# Altium project RK3568_train.PrjPcb (part 4 of 6)

## Sheet RGMII.schdoc: =
size A3; Symbol: Sheet-Symbol_A4; Company: 嘉立创EDA; Version: V1.0; Page Size: A4; @Project Name: RK3568B2地瓜派; @Page Count: 27; @Update Date: 2025-09-23; @Create Date: 2025-09-11; @Schematic Name: Schematic1; @Page No: 20; @Page Name: RGMII; Device: Sheet-Symbol_A4; Border: 1; Title Block Position: 3; Width: 1655; Height: 1170; Region Start: 1; X Region Count: 6; Y Region Count: 4; Blade Width: 10; @Board Name: Board1; @Create Time: 22:20:05; @Update Time: 09:49:09; Organization: ORGANIZATION; Address1: ADDRESS 1; Address2: ADDRESS 2; Address3: ADDRESS 3; Address4: ADDRESS 4; Revision: V1.0.0; SheetNumber: 19; SheetTotal: 28
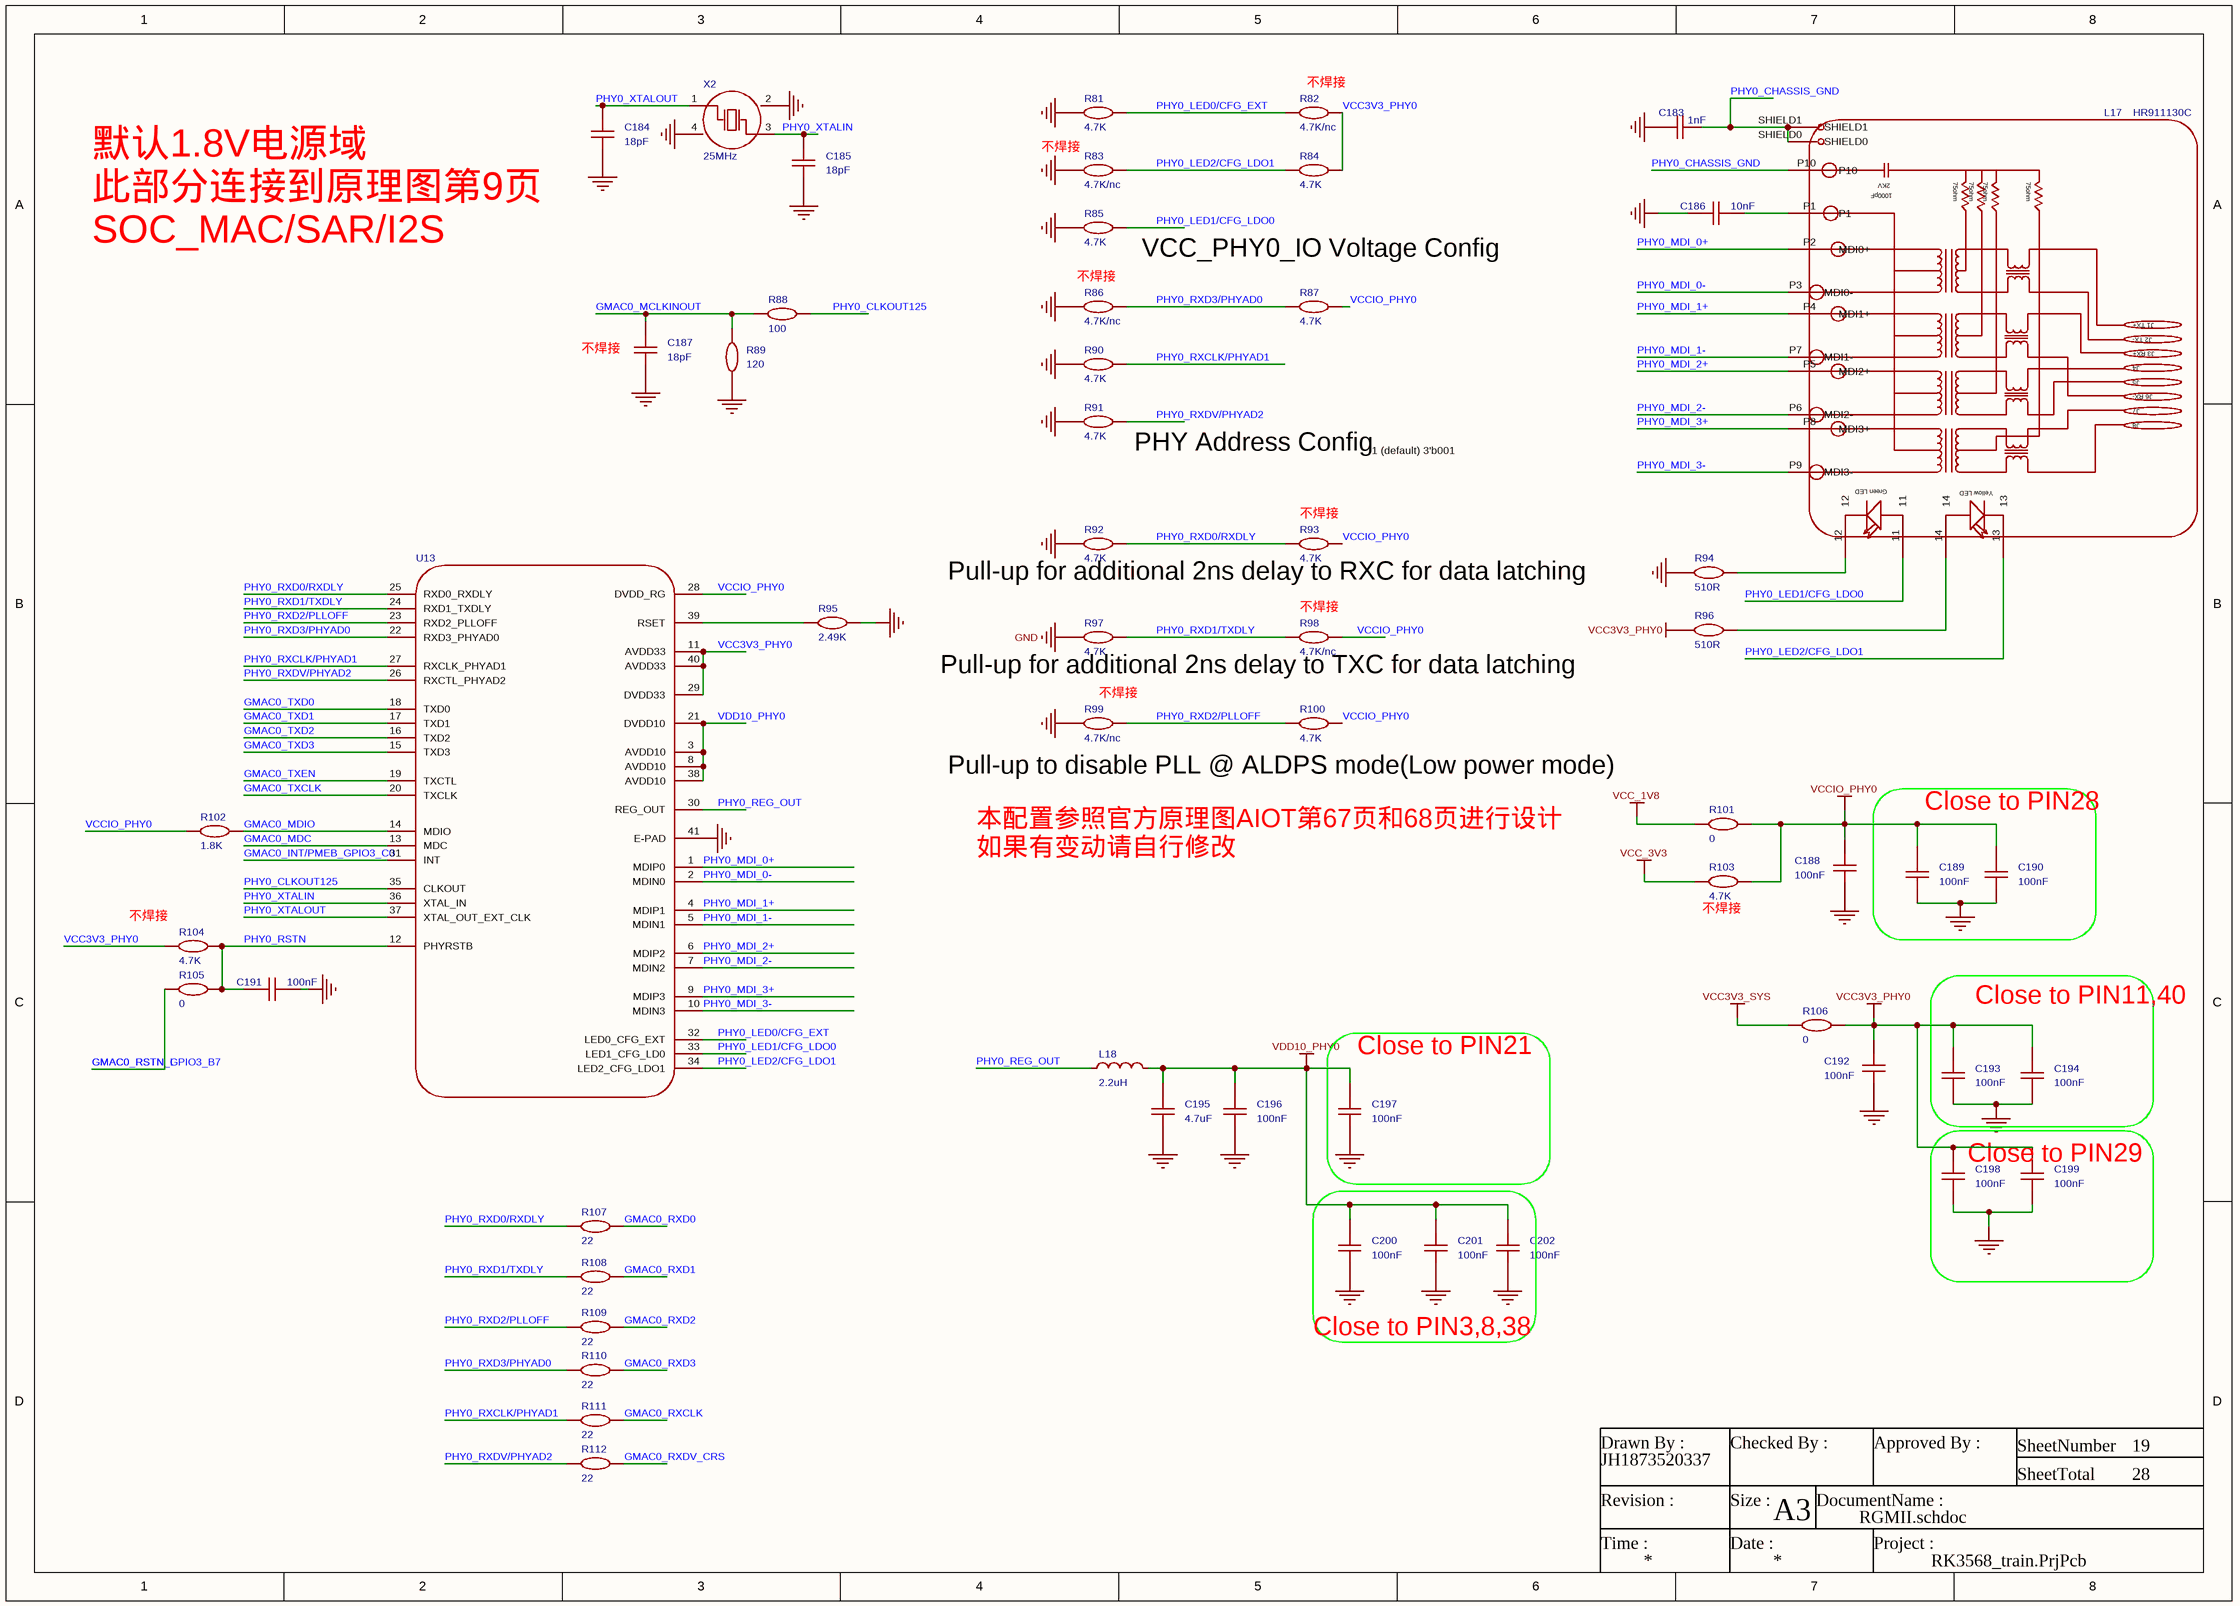
[diagram p18: RGMII.schdoc]

### Parts
C183  1nF  [C1206]
C184  value 18pF  [MYC0402]  (hidden comment: CL10A105KB8NNNC)
C185  value 18pF  [MYC0402]  (hidden comment: CL10A105KB8NNNC)
C186  value 10nF  [MYC0402]  (hidden comment: CL10A105KB8NNNC)
C187  value 18pF  [MYC0402]  (hidden comment: CL10A105KB8NNNC)
C188  100nF  [C0603]
C189  value 100nF  [MYC0402]  (hidden comment: CL10A105KB8NNNC)
C190  value 100nF  [MYC0402]  (hidden comment: CL10A105KB8NNNC)
C191  value 100nF  [MYC0402]  (hidden comment: CL10A105KB8NNNC)
C192  100nF  [C0603]
C193  value 100nF  [MYC0402]  (hidden comment: CL10A105KB8NNNC)
C194  value 100nF  [MYC0402]  (hidden comment: CL10A105KB8NNNC)
C195  4.7uF  [C0603]
C196  value 100nF  [MYC0402]  (hidden comment: CL10A105KB8NNNC)
C197  value 100nF  [MYC0402]  (hidden comment: CL10A105KB8NNNC)
C198  100nF  [C0603]
C199  value 100nF  [MYC0402]  (hidden comment: CL10A105KB8NNNC)
C200  value 100nF  [MYC0402]  (hidden comment: CL10A105KB8NNNC)
C201  value 100nF  [MYC0402]  (hidden comment: CL10A105KB8NNNC)
C202  value 100nF  [MYC0402]  (hidden comment: CL10A105KB8NNNC)
L17  HR911130C  [RJ45-TH_HR911130C]
L18  2.2uH  [IND-SMD_L2.5-W2.0_MHCHL2520]
R81  4.7K  [R0402]
R82  4.7K/nc  [R0402]
R83  4.7K/nc  [R0402]
R84  4.7K  [R0402]
R85  4.7K  [R0402]
R86  4.7K/nc  [R0402]
R87  4.7K  [R0402]
R88  100  [R0402]
R89  120  [R0402]
R90  4.7K  [R0402]
R91  4.7K  [R0402]
R92  4.7K  [R0402]
R93  4.7K  [R0402]
R94  510R  [R0402]
R95  2.49K  [R0402]
R96  510R  [R0402]
R97  4.7K  [R0402]
R98  4.7K/nc  [R0402]
R99  4.7K/nc  [R0402]
R100  4.7K  [R0402]
R101  0  [R0603]
R102  1.8K  [R0402]
R103  4.7K  [R0402]  (no BOM)
R104  4.7K  [R0402]
R105  0  [R0402]
R106  0  [R0603]
R107  22  [R0402]
R108  22  [R0402]
R109  22  [R0402]
R110  22  [R0402]
R111  22  [R0402]
R112  22  [R0402]
U13  (no value)  [RTL8211F-CG]
X2  25MHz  [CRYSTAL-SMD_4P-L3.2-W2.5-BL]

### Blocks framed on the sheet
Close to PIN28: C189 C190
Close to PIN11,40: C193 C194
Close to PIN21: C197
Close to PIN29: C198 C199
Close to PIN3,8,38: C200-C202

### Nets
GND: C183.1 C184.2 C185.2 C186.2 C187.2 C188.1 C189.2 C190.2 C191.1 C192.1 C193.2 C194.2 C195.1 C196.2 C197.2 C198.1 C199.2 C200.2 C201.2 C202.2 R81.1 R83.1 R85.1 R86.1 R89.1 R90.1 R91.1 R92.1 R94.1 R95.2 R97.1 R99.1 U13.41(E-PAD) X2.2(GND) X2.4(GND)
VCC3V3_PHY0: C192.2 C193.1 C194.1 C198.2 C199.1 R82.2 R84.2 R96.1 R104.1 R106.2 U13.11(AVDD33) U13.29(DVDD33) U13.40(AVDD33)
VCC3V3_SYS: R106.1
VCC_1V8: R101.1  [project net LCD_1V8]
VCC_3V3: R103.1  [project net TP_3V3]
VCCIO_PHY0: C188.2 C189.1 C190.1 R87.2 R93.2 R98.2 R100.2 R101.2 R102.1 R103.2 U13.28(DVDD_RG)
VDD10_PHY0: C195.2 C196.1 C197.1 C200.1 C201.1 C202.1 L18.2 U13.3(AVDD10) U13.8(AVDD10) U13.21(DVDD10) U13.38(AVDD10)
GMAC0_INT/PMEB_GPIO3_C0: U13.31(INT)
GMAC0_MCLKINOUT: C187.1 R88.1 R89.2
GMAC0_MDC: U13.13(MDC)
GMAC0_MDIO: R102.2 U13.14(MDIO)
GMAC0_RSTN_GPIO3_B7: R105.1  [also labelled GMAC0_RSTN_L]
GMAC0_RXCLK: R111.2
GMAC0_RXD0: R107.2
GMAC0_RXD1: R108.2
GMAC0_RXD2: R109.2
GMAC0_RXD3: R110.2
GMAC0_RXDV_CRS: R112.2
GMAC0_TXCLK: U13.20(TXCLK)
GMAC0_TXD0: U13.18(TXD0)
GMAC0_TXD1: U13.17(TXD1)
GMAC0_TXD2: U13.16(TXD2)
GMAC0_TXD3: U13.15(TXD3)
GMAC0_TXEN: U13.19(TXCTL)
PHY0_CHASSIS_GND: C183.2 L17.P10 L17.SHIELD0 L17.SHIELD1
PHY0_CLKOUT125: R88.2 U13.35(CLKOUT)
PHY0_LED0/CFG_EXT: R81.2 R82.1 U13.32(LED0_CFG_EXT)
PHY0_LED1/CFG_LDO0: L17.11 R85.2 U13.33(LED1_CFG_LD0)
PHY0_LED2/CFG_LDO1: L17.13 R83.2 R84.1 U13.34(LED2_CFG_LDO1)
PHY0_MDI_0+: L17.P2(MDI0+) U13.1(MDIP0)
PHY0_MDI_0-: L17.P3(MDI0-) U13.2(MDIN0)
PHY0_MDI_1+: L17.P4(MDI1+) U13.4(MDIP1)
PHY0_MDI_1-: L17.P7(MDI1-) U13.5(MDIN1)
PHY0_MDI_2+: L17.P5(MDI2+) U13.6(MDIP2)
PHY0_MDI_2-: L17.P6(MDI2-) U13.7(MDIN2)
PHY0_MDI_3+: L17.P8(MDI3+) U13.9(MDIP3)
PHY0_MDI_3-: L17.P9(MDI3-) U13.10(MDIN3)
PHY0_REG_OUT: L18.1 U13.30(REG_OUT)
PHY0_RSTN: C191.2 R104.2 R105.2 U13.12(PHYRSTB)
PHY0_RXCLK/PHYAD1: R90.2 R111.1 U13.27(RXCLK_PHYAD1)
PHY0_RXD0/RXDLY: R92.2 R93.1 R107.1 U13.25(RXD0_RXDLY)
PHY0_RXD1/TXDLY: R97.2 R98.1 R108.1 U13.24(RXD1_TXDLY)
PHY0_RXD2/PLLOFF: R99.2 R100.1 R109.1 U13.23(RXD2_PLLOFF)
PHY0_RXD3/PHYAD0: R86.2 R87.1 R110.1 U13.22(RXD3_PHYAD0)
PHY0_RXDV/PHYAD2: R91.2 R112.1 U13.26(RXCTL_PHYAD2)
PHY0_XTALIN: C185.1 U13.36(XTAL_IN) X2.3(OSC2)
PHY0_XTALOUT: C184.1 U13.37(XTAL_OUT_EXT_CLK) X2.1(OSC1)
NetC186_1: C186.1 L17.P1
NetL17_12: L17.12 R94.2
NetL17_14: L17.14 R96.2
NetR95_1: R95.1 U13.39(RSET)

### Notes on the sheet
- (near R82) 不焊接
- 不焊接
- VCC_PHY0_IO Voltage Config
- (near R86) 不焊接
- 默认1.8V电源域
  此部分连接到原理图第9页
  SOC_MAC/SAR/I2S
- (near C187) 不焊接
- (near R91) PHY Address Config
- 1 (default) 3'b001
- (near R93) 不焊接
- Pull-up for additional 2ns delay to RXC for data latching
- (near R98) 不焊接
- Pull-up for additional 2ns delay to TXC for data latching
- (near R99) 不焊接
- Pull-up to disable PLL @ ALDPS mode(Low power mode)
- (near R103) 不焊接
- (near R104) 不焊接
- 本配置参照官方原理图AIOT第67页和68页进行设计
  如果有变动请自行修改
- Drawn By :
- Checked By :
- Approved By :
- SheetNumber
- SheetTotal
- Revision :
- Time :
- Size :
- Date :
- A3
- DocumentName :
- Project :
- (in symbol HR911130C) 2KV; 75ohm; 1000pF; J1 TX+; J2 TX-; J3 RX+; J4; J5; J6 RX-; J7; J8; Green LED; Yellow LED

### Library data of the parts
C183 = 1206B102K202NT: 容值:1nF;精度:±10%;额定电压:2kV;温度系数:X7R;; Manufacturer: FH(风华); AddInBom: yes; ModelId: e4be705b945545a48e666415e3682bd8; ModelName: C1206_L3.2-W1.6-H1.3; ModelTransform: 125.984,62.992,0,0,0,0,0,0,0; Tolerance: ±10%; Voltage Rating: 2kV; Temperature Coefficient: X7R; Symbol: 1206B102K202NT; Device: 1206B102K202NT; LCSC Part Name: 1nF ±10% 2kV; SupplierPart: C9196; ManufacturerPart: 1206B102K202NT; Supplier Footprint: 1206; JLCPCB Part Class: 基础库; Datasheet: https://atta.szlcsc.com/upload/public/pdf/source/20200305/C486355_26A10D38EF8C2A5C37091D0039909270.pdf; Supplier: LCSC; ConvertToPcb: yes; FootprintName: C1206; Value: 1nF
C184-C186 C189-C191 C193 C194 C196 C197 C199-C202 = CL10A105KB8NNNC: as C174 on sheet USB; Device: CL10A105KB8NNNC; LCSC Part Name: 1uF ±10% 50V; ManufacturerPart: CL10A105KB8NNNC; Supplier Footprint: 0603; JLCPCB Part Class: Basic Part; Datasheet: https://atta.szlcsc.com/upload/public/pdf/source/20160103/1457707679084.pdf; Supplier: LCSC; ConvertToPcb: yes; FootprintName: MYC0402
C187 = CL10A105KB8NNNC: 容值:1uF;精度:±10%;额定电压:50V;材质(温度系数):X5R;; Manufacturer: SAMSUNG(三星); Symbol: CapAcitance; Add into BOM: no; ConvertToPcb: yes; ModelId: ac125912035d415993ca9572d50418b1; ModelName: C0603_L1.6-W0.8-H0.8; ModelTransform: 62.992,31.496,0,0,0,0,0,0,0; Tolerance: ±10%; Voltage Rated: 50V; Temperature Coefficient: X5R; Device: CL10A105KB8NNNC; LCSC Part Name: 1uF ±10% 50V; ManufacturerPart: CL10A105KB8NNNC; Supplier Footprint: 0603; JLCPCB Part Class: Basic Part; Datasheet: https://atta.szlcsc.com/upload/public/pdf/source/20160103/1457707679084.pdf; Supplier: LCSC; FootprintName: MYC0402
C188 C192 C195 C198 = CAP_0603: ConvertToPcb: yes; SymbolName: Capacitance; ModelId: ac125912035d415993ca9572d50418b1; ModelName: C0603_L1.6-W0.8-H0.8; ModelTransform: 62.992,31.496,0,0,0,0,0,0,0; Device: CAP_0603; AddInBom: yes; Supplier Footprint: 0603; FootprintName: C0603
  C188 C192 C198: Value: 100nF
  C195: Value: 4.7uF
L17 = HR911130C: 连接器类型:RJ45插座;端口数量:1;安装方式:弯插;屏蔽:有屏蔽;LED:带LED;等级:-;工作温度范围:-;; Manufacturer: HANRUN(汉仁); AddInBom: yes; ModelId: 59c82772a4104c30b0c5165fbd81f083; ModelTransform: 716.118,838.62,0,180,0,0,0,86.614,-157.48; Connector Type: RJ45插座; Number of Ports: 1; Shielding: 有屏蔽; LED: 带LED; Symbol: HR911130C; Device: HR911130C; LCSC Part Name: 弯插 带LED; SupplierPart: C50933; ManufacturerPart: HR911130C; Supplier Footprint: 插件; JLCPCB Part Class: 扩展库; Datasheet: https://atta.szlcsc.com/upload/public/pdf/source/20240108/FEC80AF9B295891E58BF4ACD53537D33.pdf; Supplier: LCSC; ConvertToPcb: yes; FootprintName: RJ45-TH_HR911130C; ModelName: RJ45-TH_HR911130C; Mounting Style: 弯插; Ratings: -; Operating Temperature Range: -
L18 = FTC252012S2R2MBCA: 电感值:2.2uH;精度:±20%;额定电流:3A;饱和电流(Isat):3.8A;类型:一体成型电感;; Manufacturer: cjiang(长江微电); AddInBom: yes; ModelId: 37a0cdb2b8b148059a23edc55a737e42; ModelTransform: 98.425,78.74,0,0,0,0,0,0,0; Tolerance: ±20%; Rated Current: 3A; Saturation Current (Isat): 3.8A; DC Resistance (DCR): 55mΩ; Type: 一体成型电感; Symbol: FTC252012S2R2MBCA; Device: FTC252012S2R2MBCA; LCSC Part Name: 2.2uH ±20% 3.8A; SupplierPart: C5832372; ManufacturerPart: FTC252012S2R2MBCA; Supplier Footprint: 1008; JLCPCB Part Class: 扩展库; Datasheet: https://atta.szlcsc.com/upload/public/pdf/source/20230602/8FFEDA9C0247A92A0D4B67554BFE4091.pdf; Supplier: LCSC; ConvertToPcb: yes; FootprintName: IND-SMD_L2.5-W2.0_MHCHL2520; ModelName: IND-SMD_L2.5-W2.0_MHCHL2520; Value: 2.2uH
R81 R84 R85 R87-R92 R94-R97 R100 R102-R105 R107-R112 = Res_0402: as R50 on sheet SOC_FLASH; Device: Res_0402; AddInBom: yes; Supplier Footprint: 0402; FootprintName: R0402
  R81 R84 R85 R87 R90-R92 R97 R100 R103 R104: Value: 4.7K
  R88: Value: 100
  R89: Value: 120
  R94 R96: Value: 510R
  R95: Value: 2.49K
  R102: Value: 1.8K
  R105: Value: 0
  R107-R112: Value: 22
R82 R86 R93 R98 R99 = Res_0402: Symbol: 电阻; Add into BOM: no; ConvertToPcb: yes; ModelId: 671aefced39d4c318694bba8bd8efd39; ModelName: R0402_L1.0-W0.5-H0.5; ModelTransform: 39.37,19.685,0,0,0,0,0,0.0005,0; Device: Res_0402; Supplier Footprint: 0402; FootprintName: R0402
  R82 R86 R98 R99: Value: 4.7K/nc
  R93: Value: 4.7K
R83 = Res_0402: Symbol: 电阻; Convert to PCB: yes; Add into BOM: no; ModelId: 671aefced39d4c318694bba8bd8efd39; ModelName: R0402_L1.0-W0.5-H0.5; ModelTransform: 39.37,19.685,0,0,0,0,0,0.0005,0; Value: 4.7K/nc; Device: Res_0402; Supplier Footprint: 0402; FootprintName: R0402
R101 R106 = Res_0603: Symbol: 电阻; ConvertToPcb: yes; ModelId: fc143cca1e79419f9cd78b61e9279f08; ModelTransform: 31.8897,63.7794,0,90,0,0,0,0,0; Value: 0; Device: Res_0603; AddInBom: yes; Supplier Footprint: 0603; FootprintName: R0603; ModelName: R0603
U13 = RTL8211F-CG: AddInBom: yes; Symbol: RTL8211F-CG; Device: RTL8211F-CG; ConvertToPcb: yes; FootprintName: RTL8211F-CG
X2 = X322525MOB4SI: 晶振类型:贴片晶振;频率:25MHz;常温频差:±10ppm;负载电容:12pF;频率稳定度:±20ppm;; Manufacturer: YXC(扬兴晶振); AddInBom: yes; ModelId: 02485e56ba8d4732a26526d2983fc729; ModelTransform: 125.984,98.425,0,0,0,0,0,0,0; Normal temperature Frequency Tolerance: ±10ppm; Load Capacitance: 12pF; Frequency Stability: ±20ppm; Symbol: X322525MOB4SI; Device: X322525MOB4SI; LCSC Part Name: YSX321SL 25MHZ 4P 3225 12PF ±10PPM -40~85℃ (±20PPM); SupplierPart: C9006; ManufacturerPart: X322525MOB4SI; Supplier Footprint: SMD3225-4P; JLCPCB Part Class: 基础库; Datasheet: https://item.szlcsc.com/datasheet/X322525MOB4SI/9526.html; Supplier: LCSC; ConvertToPcb: yes; FootprintName: CRYSTAL-SMD_4P-L3.2-W2.5-BL; ModelName: CRYSTAL-SMD_4P-L3.2-W2.5-BL; Type: 贴片晶振; Value: 25MHz; Operating Temperature: -40℃~+85℃

## Sheet SD.schdoc: =
size A4; Symbol: Sheet-Symbol_A4; Company: 嘉立创EDA; Version: V1.0; Page Size: A4; @Project Name: RK3568B2地瓜派; @Page Count: 26; @Update Date: 2025-09-11; @Create Date: 2025-09-11; @Schematic Name: Schematic1; @Page No: 22; @Page Name: SD; Device: Sheet-Symbol_A4; Border: 1; Title Block Position: 3; Width: 1170; Height: 825; Region Start: 1; X Region Count: 6; Y Region Count: 4; Blade Width: 10; @Board Name: Board1; @Create Time: 22:25:58; @Update Time: 22:26:15; Organization: ORGANIZATION; Address1: ADDRESS 1; Address2: ADDRESS 2; Address3: ADDRESS 3; Address4: ADDRESS 4; Revision: V1.0.0; SheetNumber: 20; SheetTotal: 28
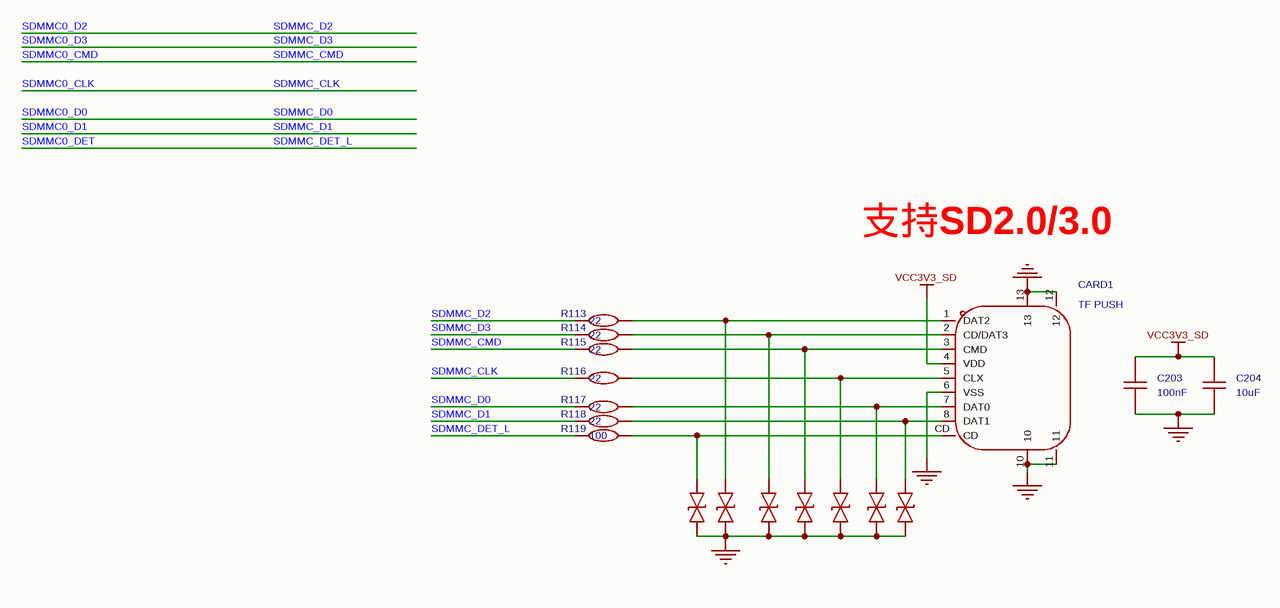
[diagram p19: SD.schdoc]

### Parts
C203  100nF  [C0603]
C204  value 10uF  [MYC0402]  (hidden comment: CL10A105KB8NNNC)
CARD1  TF PUSH  [TF-SMD_TF-PUSH]
R113  22  [R0402]
R114  22  [R0402]
R115  22  [R0402]
R116  22  [R0402]
R117  22  [R0402]
R118  22  [R0402]
R119  100  [R0402]
U14  ESD5341N  [DFN1006-2L-BI]  (value not drawn)
U15  ESD5341N  [DFN1006-2L-BI]  (value not drawn)
U16  ESD5341N  [DFN1006-2L-BI]  (value not drawn)
U17  ESD5341N  [DFN1006-2L-BI]  (value not drawn)
U18  ESD5341N  [DFN1006-2L-BI]  (value not drawn)
U19  ESD5341N  [DFN1006-2L-BI]  (value not drawn)
U20  ESD5341N  [DFN1006-2L-BI]  (value not drawn)

### Nets
GND: C203.1 C204.2 CARD1.6(VSS) CARD1.10 CARD1.11 CARD1.12 CARD1.13 U14.1 U15.1 U16.1 U17.1 U18.1 U19.1 U20.1
VCC3V3_SD: C203.2 C204.1 CARD1.4(VDD)
SDMMC0_CLK: R116.1  [also labelled SDMMC_CLK]
SDMMC0_CMD: R115.1  [also labelled SDMMC_CMD]
SDMMC0_D0: R117.1  [also labelled SDMMC_D0]
SDMMC0_D1: R118.1  [also labelled SDMMC_D1]
SDMMC0_D2: R113.1  [also labelled SDMMC_D2]
SDMMC0_D3: R114.1  [also labelled SDMMC_D3]
SDMMC0_DET: R119.1  [also labelled SDMMC_DET_L]
NetCARD1_1: CARD1.1(DAT2) R113.2 U15.2
NetCARD1_2: CARD1.2(CD/DAT3) R114.2 U16.2
NetCARD1_3: CARD1.3(CMD) R115.2 U17.2
NetCARD1_5: CARD1.5(CLX) R116.2 U18.2
NetCARD1_7: CARD1.7(DAT0) R117.2 U19.2
NetCARD1_8: CARD1.8(DAT1) R118.2 U20.2
NetCARD1_CD: CARD1.CD R119.2 U14.2

### Notes on the sheet
- 支持SD2.0/3.0
- Drawn By :
- Checked By :
- Approved By :
- SheetNumber
- SheetTotal
- Revision :
- Time :
- Size :
- Date :
- A4
- DocumentName :
- Project :

### Library data of the parts
C203 = CAP_0603: as C188 on sheet RGMII; Device: CAP_0603; AddInBom: yes; Supplier Footprint: 0603; FootprintName: C0603; Value: 100nF
C204 = CL10A105KB8NNNC: as C174 on sheet USB; Device: CL10A105KB8NNNC; LCSC Part Name: 1uF ±10% 50V; ManufacturerPart: CL10A105KB8NNNC; Supplier Footprint: 0603; JLCPCB Part Class: Basic Part; Datasheet: https://atta.szlcsc.com/upload/public/pdf/source/20160103/1457707679084.pdf; Supplier: LCSC; ConvertToPcb: yes; FootprintName: MYC0402
CARD1 = TF PUSH: 卡连接方式:自弹式;卡类型:MicroSD卡(TF卡);连接器类型:卡座;本体最大高度:2mm;工作温度范围:-20℃~+90℃;; Manufacturer: SHOU HAN(首韩); AddInBom: yes; ModelId: 2d6270e77c9a43c6bb0aca962ba811a2; ModelTransform: 635.826,598.424,0,0,0,0,0.002,-82.441,-23.622; Card Connection Mode: 自弹式; Connector Type: 卡座; Additional Card Detection Pins: 无; Maximum Body Height: 2mm; Symbol: TF PUSH; Device: TF PUSH; LCSC Part Name: 自弹式 MicroSD卡(TF卡) 卡座; SupplierPart: C393941; ManufacturerPart: TF PUSH; Supplier Footprint: SMD; JLCPCB Part Class: 扩展库; Datasheet: https://atta.szlcsc.com/upload/public/pdf/source/20191011/C393941_0DDD896EE907FEB750D8B7B8982E2A67.pdf; Supplier: LCSC; ConvertToPcb: yes; FootprintName: TF-SMD_TF-PUSH; ModelName: TF-SMD_TF-PUSH; Card Type: MicroSD卡(TF卡); Supplementary Features: -; Operating Temperature Range: -20℃~+90℃
R113-R119 = Res_0402: as R51 on sheet SOC_FLASH; Device: Res_0402; AddInBom: yes; Supplier Footprint: 0402; FootprintName: R0402
  R113-R118: Value: 22
  R119: Value: 100
U14-U20 = ESD5341N_C20612964: Manufacturer: KUU; AddInBom: yes; ModelId: 2bdbcca3b35b49c5a8ae725a08658930; ModelTransform: 40.1574,24.4094,0,0,0,0,0,0,0; Symbol: ESD5341N_C20612964; Device: ESD5341N_C20612964; LCSC Part Name: ESD静电保护管; SupplierPart: C20612964; ManufacturerPart: ESD5341N; Supplier Footprint: DFN1006-2L; JLCPCB Part Class: 扩展库; Datasheet: https://atta.szlcsc.com/upload/public/pdf/source/20240126/9EE8C033ACD76A81C21292FAA1DFE4C1.pdf; Supplier: LCSC; ConvertToPcb: yes; FootprintName: DFN1006-2L-BI; ModelName: DFN1006-2L-BI

## Sheet HDMI.schdoc: =
size A4; Symbol: Sheet-Symbol_A4; Company: 嘉立创EDA; Version: V1.0; Page Size: A4; @Project Name: RK3568B2地瓜派; @Page Count: 26; @Update Date: 2025-09-11; @Create Date: 2025-09-11; @Schematic Name: Schematic1; @Page No: 19; @Page Name: HDMI; Device: Sheet-Symbol_A4; Border: 1; Title Block Position: 3; Width: 1170; Height: 825; Region Start: 1; X Region Count: 6; Y Region Count: 4; Blade Width: 10; @Board Name: Board1; @Create Time: 22:18:09; @Update Time: 22:18:53; Organization: ORGANIZATION; Address1: ADDRESS 1; Address2: ADDRESS 2; Address3: ADDRESS 3; Address4: ADDRESS 4; Revision: V1.0.0; SheetNumber: 21; SheetTotal: 28
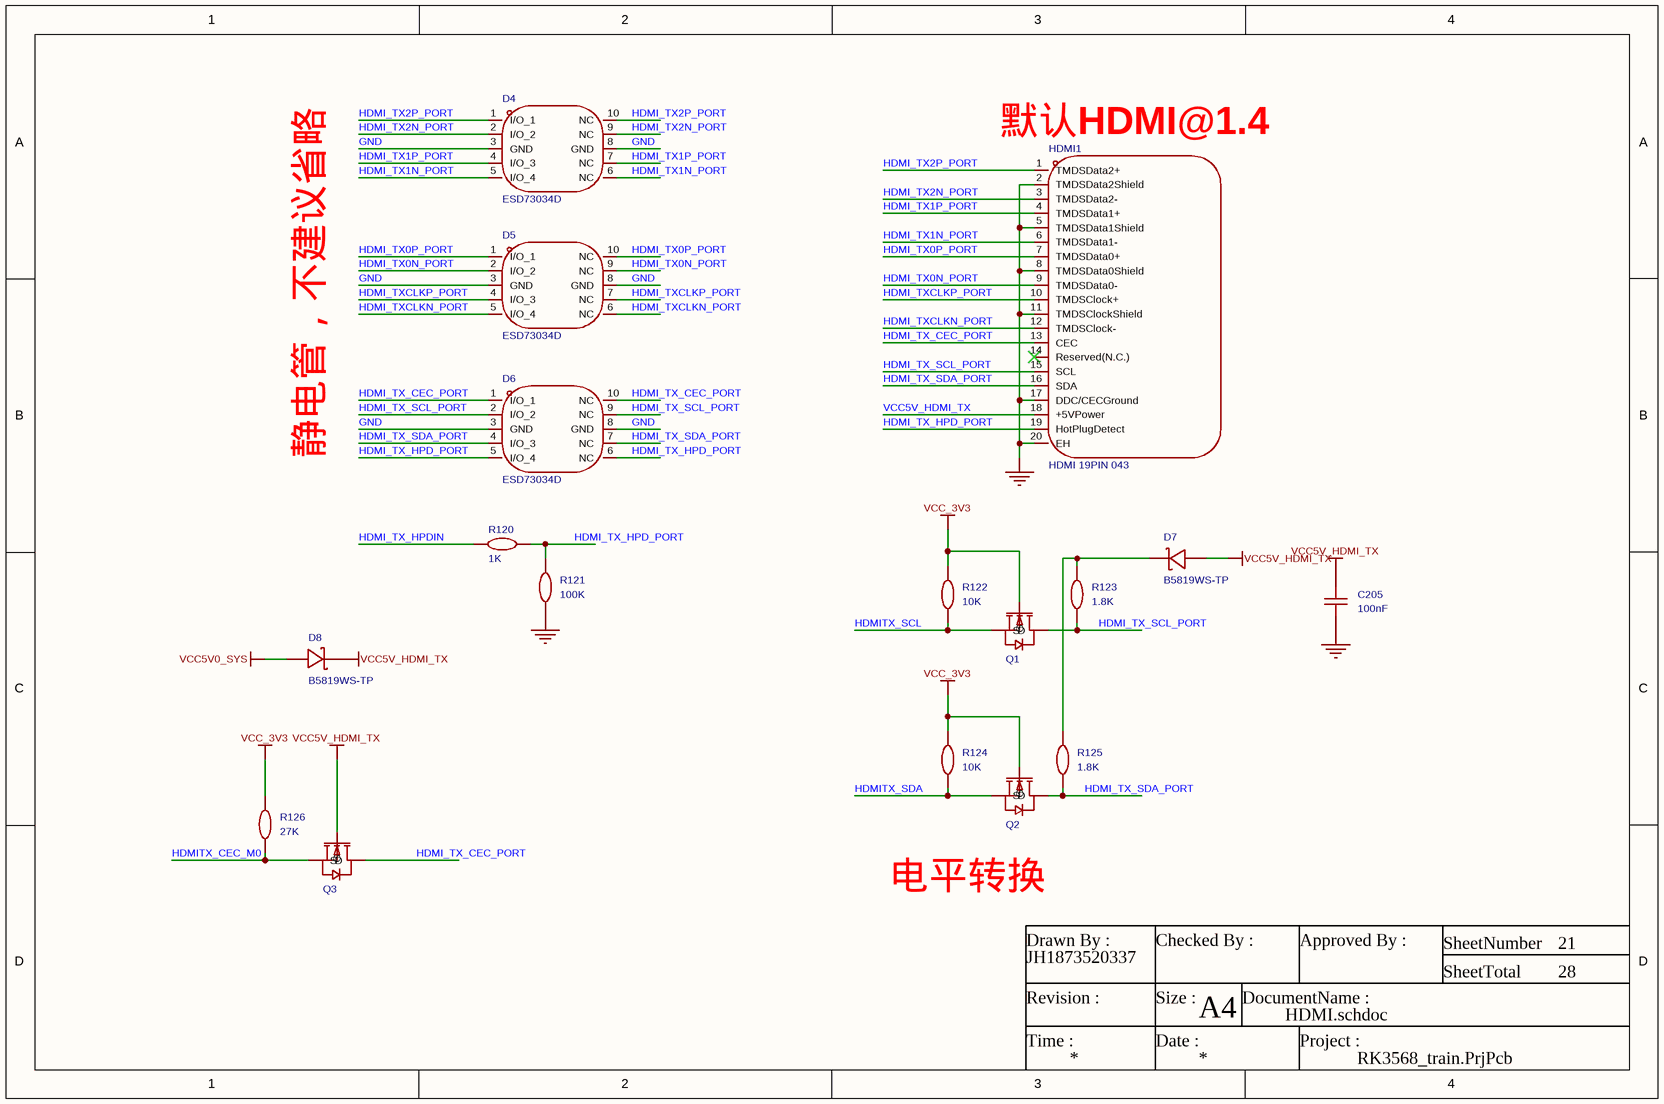
[diagram p20: HDMI.schdoc]

### Parts
C205  100nF  [C0603]
D4  ESD73034D  [DFN-10_L2.5-W1.0-P0.50-BL-2]
D5  ESD73034D  [DFN-10_L2.5-W1.0-P0.50-BL-2]
D6  ESD73034D  [DFN-10_L2.5-W1.0-P0.50-BL-2]
D7  B5819WS-TP  [SOD-323_L1.8-W1.3-LS2.5-RD]
D8  B5819WS-TP  [SOD-323_L1.8-W1.3-LS2.5-RD]
HDMI1  HDMI 19PIN 043  [HDMI-SMD_HDMI-19PIN-043]
Q1  (no value)  [SOT-23-3_L2.9-W1.3-P1.90-LS2.4-BR]
Q2  (no value)  [SOT-23-3_L2.9-W1.3-P1.90-LS2.4-BR]
Q3  (no value)  [SOT-23-3_L2.9-W1.3-P1.90-LS2.4-BR]
R120  1K  [R0402]
R121  100K  [R0402]
R122  10K  [R0402]
R123  1.8K  [R0402]
R124  10K  [R0402]
R125  1.8K  [R0402]
R126  27K  [R0402]

### Nets
GND: C205.1 D4.3(GND) D4.8(GND) D5.3(GND) D5.8(GND) D6.3(GND) D6.8(GND) HDMI1.2(TMDSData2Shield) HDMI1.5(TMDSData1Shield) HDMI1.8(TMDSData0Shield) HDMI1.11(TMDSClockShield) HDMI1.17(DDC/CECGround) HDMI1.20(EH) R121.1
VCC5V0_SYS: D8.2(A)
VCC5V_HDMI_TX: C205.2 D7.2(A) D8.1(K) HDMI1.18(+5VPower) Q3.1(G)
VCC_3V3: Q1.1(G) Q2.1(G) R122.2 R124.2 R126.2  [project net TP_3V3]
HDMI_TX0N_PORT: D5.2(I/O_2) D5.9(NC) HDMI1.9(TMDSData0-)
HDMI_TX0P_PORT: D5.1(I/O_1) D5.10(NC) HDMI1.7(TMDSData0+)
HDMI_TX1N_PORT: D4.5(I/O_4) D4.6(NC) HDMI1.6(TMDSData1-)
HDMI_TX1P_PORT: D4.4(I/O_3) D4.7(NC) HDMI1.4(TMDSData1+)
HDMI_TX2N_PORT: D4.2(I/O_2) D4.9(NC) HDMI1.3(TMDSData2-)
HDMI_TX2P_PORT: D4.1(I/O_1) D4.10(NC) HDMI1.1(TMDSData2+)
HDMI_TX_CEC_PORT: D6.1(I/O_1) D6.10(NC) HDMI1.13(CEC) Q3.3(D)
HDMI_TX_HPD_PORT: D6.5(I/O_4) D6.6(NC) HDMI1.19(HotPlugDetect) R120.2 R121.2
HDMI_TX_HPDIN: R120.1
HDMI_TX_SCL_PORT: D6.2(I/O_2) D6.9(NC) HDMI1.15(SCL) Q1.3(D) R123.1
HDMI_TX_SDA_PORT: D6.4(I/O_3) D6.7(NC) HDMI1.16(SDA) Q2.3(D) R125.1
HDMI_TXCLKN_PORT: D5.5(I/O_4) D5.6(NC) HDMI1.12(TMDSClock-)
HDMI_TXCLKP_PORT: D5.4(I/O_3) D5.7(NC) HDMI1.10(TMDSClock+)
HDMITX_CEC_M0: Q3.2(S) R126.1
HDMITX_SCL: Q1.2(S) R122.1
HDMITX_SDA: Q2.2(S) R124.1
NetD7_1: D7.1(K) R123.2 R125.2

Not connected (* = marked no-connect by the designer): HDMI1 14(Reserved(N.C.))*

### Notes on the sheet
- 静电管，不建议省略
- (near HDMI1) 默认HDMI@1.4
- 电平转换
- Drawn By :
- Checked By :
- Approved By :
- SheetNumber
- SheetTotal
- Revision :
- Time :
- Size :
- Date :
- A4
- DocumentName :
- Project :

### Library data of the parts
C205 = CAP_0603: as C188 on sheet RGMII; Device: CAP_0603; AddInBom: yes; Supplier Footprint: 0603; FootprintName: C0603; Value: 100nF
D4-D6 = ESD73034D: as D3 on sheet USB; Symbol: ESD73034D; Device: ESD73034D; LCSC Part Name: ESD73034D-10/TR; SupplierPart: C7202962; ManufacturerPart: ESD73034D; Supplier Footprint: DFN2510-10; JLCPCB Part Class: 扩展库; Datasheet: https://item.szlcsc.com/datasheet/ESD73034D/8170920.html; Supplier: LCSC; ConvertToPcb: yes; FootprintName: DFN-10_L2.5-W1.0-P0.50-BL-2; ModelName: DFN-10_L2.5-W1.0-P0.50-BL-2; Peak Pulse Current (Ipp): 3A@8/20us; Peak Pulse Power Dissipation (Ppp): 60W@8/20us
D7 D8 = B5819WS-TP: 正向压降(Vf):600mV@1A;直流反向耐压(Vr):40V;平均整流电流(Io):1A;; Manufacturer: MCC(美微科); AddInBom: yes; ModelId: 7459fe65e23146c0a8d836e46a0add72; ModelTransform: 104.3305,51.181,0,0,0,0,0,0,0; Reverse Voltage (Vr): 40V; Average Rectified Current (Io): 1A; Reverse Leakage Current (Ir): 1mA@40V; Symbol: B5819WS-TP; Device: B5819WS-TP; LCSC Part Name: 电压:40V 电流:1A; SupplierPart: C78734; ManufacturerPart: B5819WS-TP; Supplier Footprint: SOD-323; JLCPCB Part Class: 扩展库; Datasheet: https://atta.szlcsc.com/upload/public/pdf/source/20190308/C78734_7BD7F562D63F05C7B4187010ADA330AA.pdf; Supplier: LCSC; ConvertToPcb: yes; FootprintName: SOD-323_L1.8-W1.3-LS2.5-RD; ModelName: SOD-323_L1.8-W1.3-LS2.5-RD; Forward Voltage (Vf@If): 600mV@1A
HDMI1 = HDMI 19PIN 043: USB母座/HD-MI 19PIN母座 4脚插件 贴片19PIN 铁壳镀镍; Manufacturer: SHOU HAN(首韩); AddInBom: yes; ModelId: c61f66854239499383675c08a93d807c; ModelName: HDMI-SMD_HDMI-9PIN-043; ModelTransform: 590.55,474.4085,0,0,0,0,0,-71.654,-78.74; Connector Type: HDMI-A; Gender: 母; Current Rating (Max): 300mA; Rated Voltage (Max): 40V; Symbol: HDMI 19PIN 043; Device: HDMI 19PIN 043; LCSC Part Name: HDMI 19PIN 043; SupplierPart: C2858275; ManufacturerPart: HDMI 19PIN 043; Supplier Footprint: SMD; JLCPCB Part Class: 扩展库; Datasheet: https://atta.szlcsc.com/upload/public/pdf/source/20210728/C2858275_DF299413048A9CF092C2A61AB97004F4.pdf; Supplier: LCSC; ConvertToPcb: yes; FootprintName: HDMI-SMD_HDMI-19PIN-043; Number of Pins: 19P; Mounting Style: 卧贴; Operating Temperature Range: -55℃~+85℃
Q1-Q3 = AO3400A_N: 类型:N沟道;漏源电压(Vdss):30V;连续漏极电流(Id):5.2A;功率(Pd):1W;导通电阻(RDS(on)@Vgs,Id):35mΩ@10V,5A;阈值电压(Vgs(th)@Id):1.5V@250μA;; Symbol: N_MOS; AddInBom: yes; ModelId: c62791f0466c4ae2a892c056b845b0ca; ModelName: SOT-23-3P_L2.9-W1.3-H1.0-LS2.4-P0.95; ModelTransform: 98.425,114.173,0,180,0,0,0.0005,-0.0005,0; Device: AO3400A_N; Supplier Footprint: SOT-23; ConvertToPcb: yes; FootprintName: SOT-23-3_L2.9-W1.3-P1.90-LS2.4-BR; SupplierPart: C700953
R120-R126 = Res_0402: as R51 on sheet SOC_FLASH; Device: Res_0402; AddInBom: yes; Supplier Footprint: 0402; FootprintName: R0402
  R120: Value: 1K
  R121: Value: 100K
  R122 R124: Value: 10K
  R123 R125: Value: 1.8K
  R126: Value: 27K